# Altium schematic sheet Camera module.SchDoc
size A3; SheetNumber: 6; SheetTotal: 9
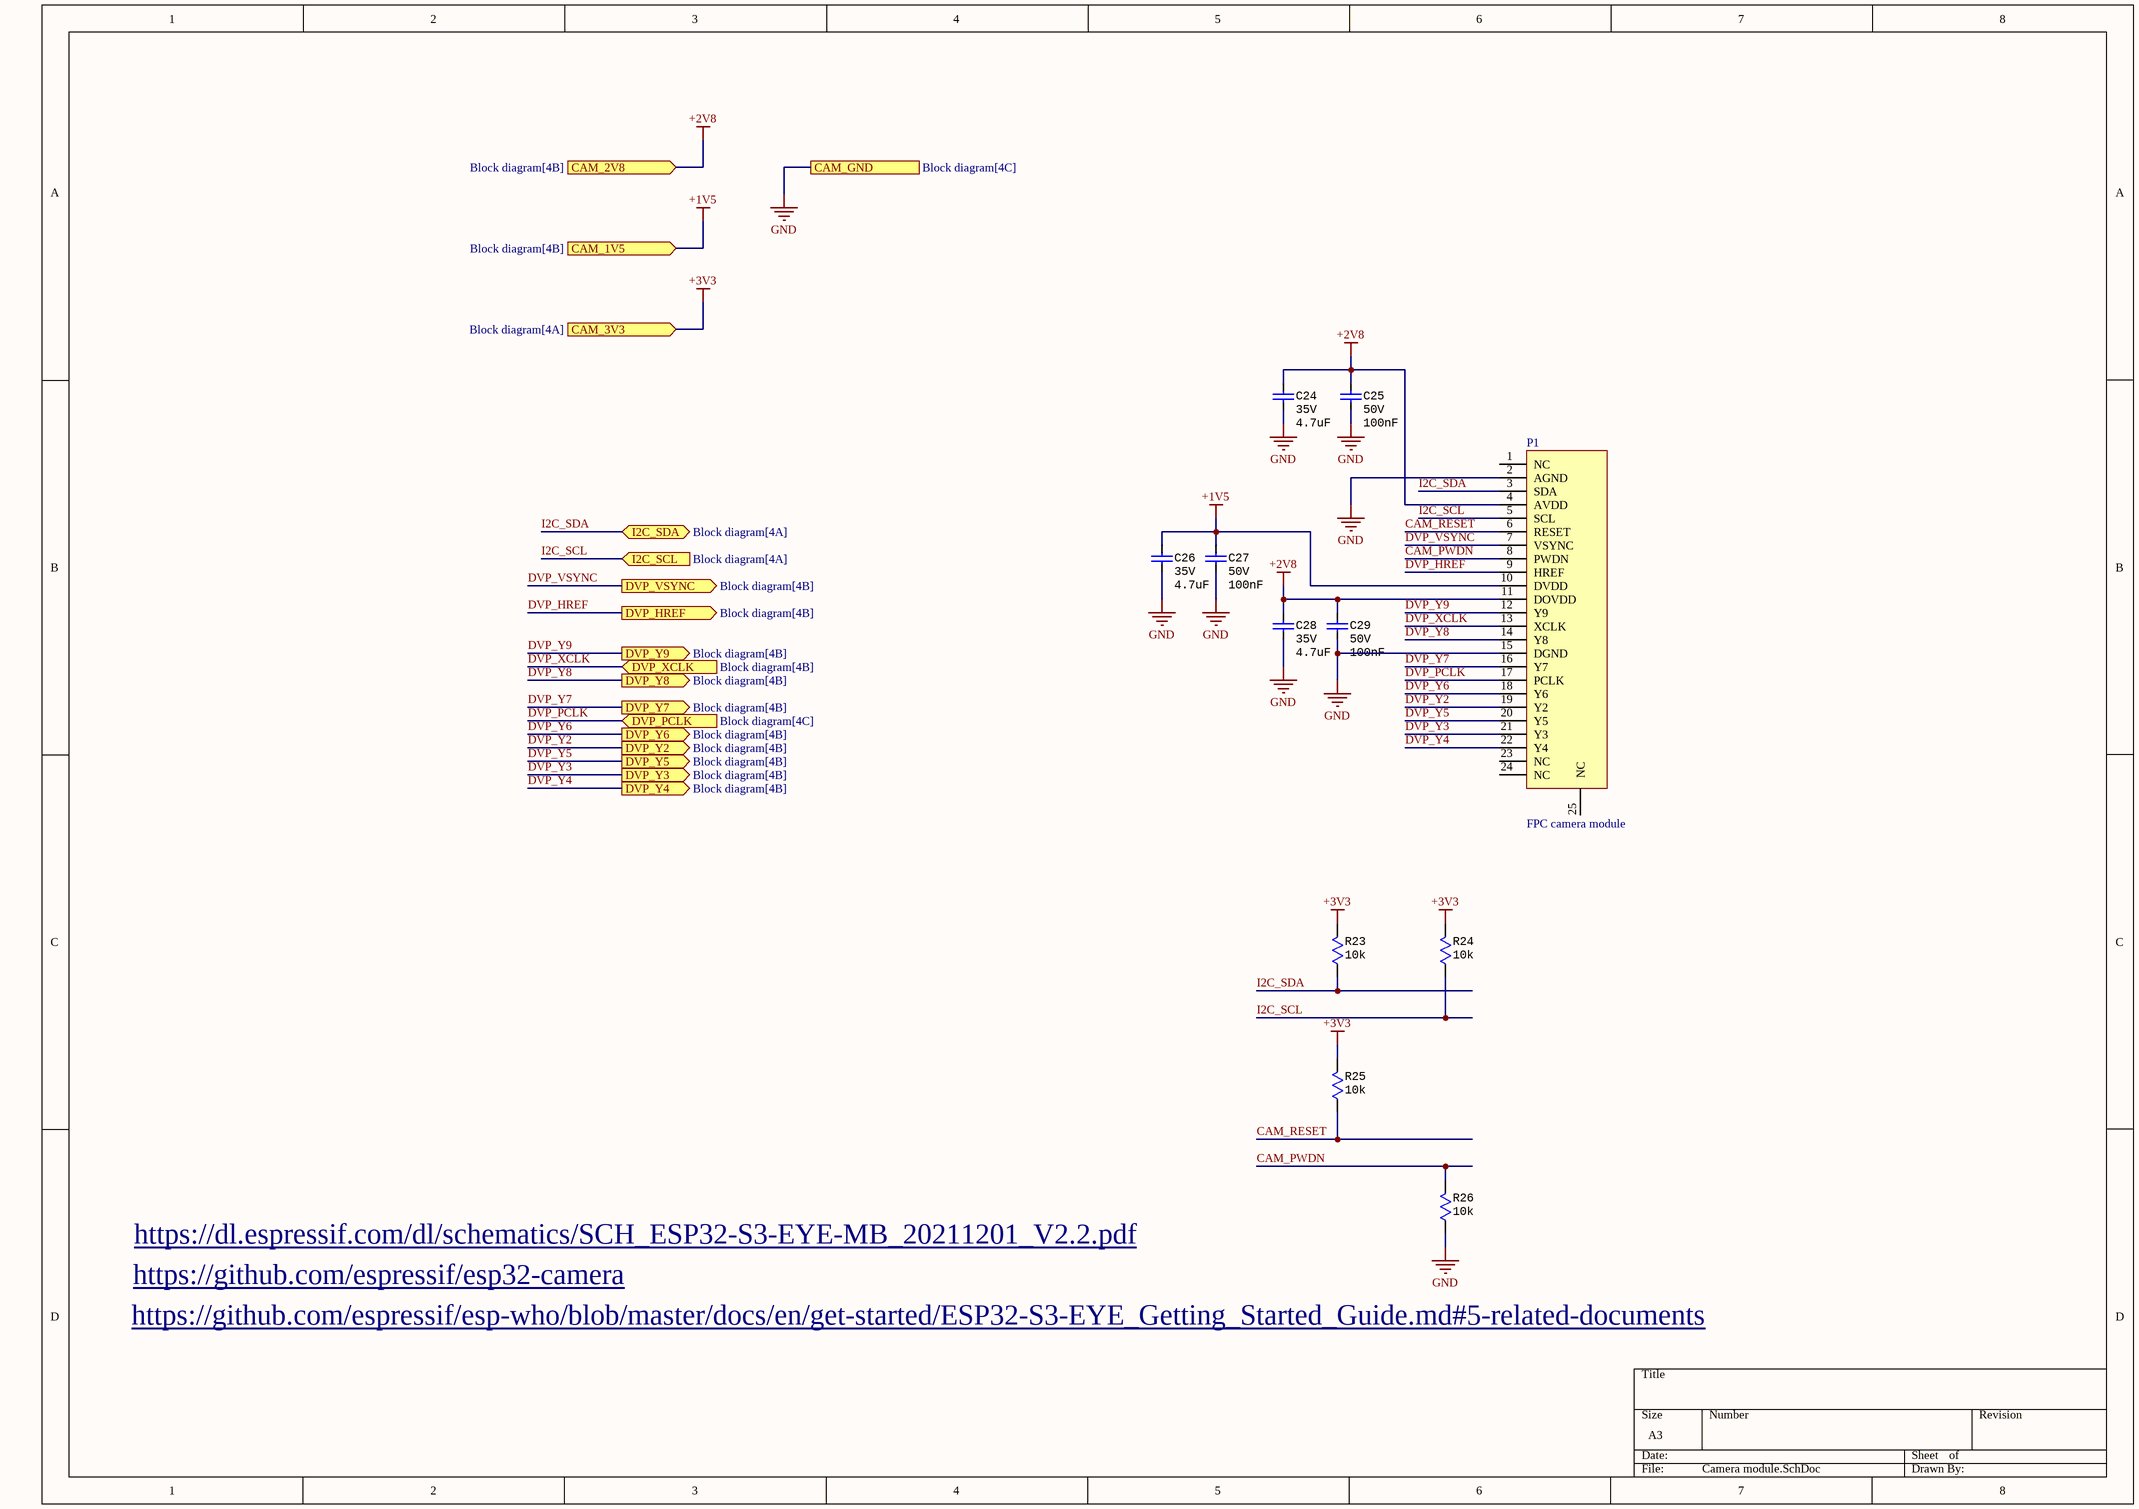
[diagram p0: Camera module.SchDoc]

## Parts
C24  Voltage: 35V  [CAP Ceramic SMD 0603]  (hidden comment: 4.7uF)
C25  Voltage: 50V  [CAP Ceramic SMD 0603]  (hidden comment: 100nF)
C26  Voltage: 35V  [CAP Ceramic SMD 0603]  (hidden comment: 4.7uF)
C27  Voltage: 50V  [CAP Ceramic SMD 0603]  (hidden comment: 100nF)
C28  Voltage: 35V  [CAP Ceramic SMD 0603]  (hidden comment: 4.7uF)
C29  Voltage: 50V  [CAP Ceramic SMD 0603]  (hidden comment: 100nF)
P1  FPC camera module  [FPC24 Camera Module]
R23  value 10k  [RES SMD 0603]  (hidden comment: 10kR)
R24  value 10k  [RES SMD 0603]  (hidden comment: 10kR)
R25  value 10k  [RES SMD 0603]  (hidden comment: 10kR)
R26  value 10k  [RES SMD 0603]  (hidden comment: 10kR)

## Ports
CAM_1V5 (in, see Block diagram[4B]), CAM_2V8 (in, see Block diagram[4B]), CAM_3V3 (in, see Block diagram[4A]), CAM_GND (see Block diagram[4C]), DVP_HREF (out, see Block diagram[4B]), DVP_PCLK (in, see Block diagram[4C]), DVP_VSYNC (out, see Block diagram[4B]), DVP_XCLK (in, see Block diagram[4B]), DVP_Y2 (out, see Block diagram[4B]), DVP_Y3 (out, see Block diagram[4B]), DVP_Y4 (out, see Block diagram[4B]), DVP_Y5 (out, see Block diagram[4B]), DVP_Y6 (out, see Block diagram[4B]), DVP_Y7 (out, see Block diagram[4B]), DVP_Y8 (out, see Block diagram[4B]), DVP_Y9 (out, see Block diagram[4B]), I2C_SCL (in, see Block diagram[4A]), I2C_SDA (bidir, see Block diagram[4A])

## Nets
+1V5: C26.1 C27.1 P1.10(DVDD) ; port CAM_1V5
+2V8: C24.1 C25.1 C28.1 C29.1 P1.4(AVDD) P1.11(DOVDD) ; port CAM_2V8
+3V3: R23.2 R24.2 R25.2 ; port CAM_3V3
GND: C24.2 C25.2 C26.2 C27.2 C28.2 C29.2 P1.2(AGND) P1.15(DGND) R26.1 ; port CAM_GND
CAM_PWDN: P1.8(PWDN) R26.2
CAM_RESET: P1.6(RESET) R25.1
DVP_HREF: P1.9(HREF) ; port DVP_HREF
DVP_PCLK: P1.17(PCLK) ; port DVP_PCLK
DVP_VSYNC: P1.7(VSYNC) ; port DVP_VSYNC
DVP_XCLK: P1.13(XCLK) ; port DVP_XCLK
DVP_Y2: P1.19(Y2) ; port DVP_Y2
DVP_Y3: P1.21(Y3) ; port DVP_Y3
DVP_Y4: P1.22(Y4) ; port DVP_Y4
DVP_Y5: P1.20(Y5) ; port DVP_Y5
DVP_Y6: P1.18(Y6) ; port DVP_Y6
DVP_Y7: P1.16(Y7) ; port DVP_Y7
DVP_Y8: P1.14(Y8) ; port DVP_Y8
DVP_Y9: P1.12(Y9) ; port DVP_Y9
I2C_SCL: P1.5(SCL) R24.1 ; port I2C_SCL
I2C_SDA: P1.3(SDA) R23.1 ; port I2C_SDA

Not connected (* = marked no-connect by the designer): P1 1(NC) 23(NC) 24(NC) 25(NC)

## Notes on the sheet
- https://dl.espressif.com/dl/schematics/SCH_ESP32-S3-EYE-MB_20211201_V2.2.pdf
- https://github.com/espressif/esp32-camera
- https://github.com/espressif/esp-who/blob/master/docs/en/get-started/ESP32-S3-EYE_Getting_Started_Guide.md#5-related-documents

## Library data of the parts
C24 C26 C28 = CAP 0603 4.7uF 35V: Multilayer Ceramic Capacitor, 4.7 uF, 35 V, ± 10%, X5R, 0603 [1608 Metric]; Manufacturer: Murata; Manufacturer Part Number: GRM188R6YA475KE15D; Supplier 1: LCSC; Supplier Part Number 1: C162274; RoHS: Yes; Category: Ceramic Capacitors; Stock 1: 52180; Pricing 1: 10=0.05850, 100=0.04900, 300=0.04430, 1000=0.03020, 4000=0.02820, 8000=0.02710 (USD); Mount: Surface Mount; Case/Package: 0603; Case Code (Metric): 1608; Case Code (Imperial): 0603; Weight: 0.000222oz; Material: Ceramic; Min Operating Temperature: -55°C; Max Operating Temperature: 85°C; Capacitance: 4.7uF; Tolerance: 10%; Voltage Rating: 35V; Packaging: Tape and Reel; Package Quantity: 1; Dielectric: X5R; Series: GRM; Voltage Rating (DC): 35V; Termination: SMD/SMT; Resistor Type: Ceramic; Length: 1.6mm; Width: 0.8mm; Height: 0.8mm; Thickness: 0.031inch; Depth: 0.8mm; RoHS Compliant: Yes; Lead Free: Lead Free; Reach SVHC Compliant: Yes; Value: 4.7uF
C25 C27 C29 = CAP 0603 100nF 50V: Multilayer Ceramic Capacitors MLCC Surface Mount 0603 0.1uF 50 Volts X7R 10%; Manufacturer: Murata; Manufacturer Part Number: GRM188R71H104KA93D; Insulation Resistance: 10GR; Supplier 1: LCSC; RoHS: Yes; Category: Ceramic Capacitors; Stock 1: 3546650; Pricing 1: 50=0.00420, 500=0.00330, 1500=0.00290, 5000=0.00260, 25000=0.00250, 50000=0.00240 (USD); Mount: Surface Mount; Case/Package: 0603; Number of Pins: 2; Case Code (Imperial): 0603; Case Code (Metric): 1608; Dielectric Material: Ceramic; Material: Ceramic; Contact Plating: Tin,Matte; Min Operating Temperature: -55°C; Max Operating Temperature: 125°C; Capacitance: 100nF; Tolerance: 10%; Packaging: Tape and Reel; Dielectric: X7R; Voltage Rating (DC): 50V; Termination: SMD/SMT; Package Quantity: 1; Voltage Rating: 50V; Length: 1.6mm; Width: 0.8mm; Height: 0.8mm; Depth: 0.8mm; Thickness: 0.035inch; Radiation Hardening: No; RoHS Compliant: Yes; REACH SVHC: No SVHC; Lead Free: Lead Free; ComponentLink1URL: https://datasheet.ciiva.com/19467/1857604-19467681.pdf?src-supplier=Jameco; ComponentLink1Description: https://datasheet.ciiva.com/19467/1857604-19467681.pdf?src-supplier=Jameco; ComponentLink2URL: https://datasheet.ciiva.com/11786/0900766b807a1cab-11786047.pdf?src-supplier=RSComponents; ComponentLink2Description: https://datasheet.ciiva.com/11786/0900766b807a1cab-11786047.pdf?src-supplier=RSComponents; ComponentLink3URL: https://datasheet.ciiva.com/29201/451744-da-01-en-vs-kondensator-0603-29201904.pdf?src-supplier=Conrad; ComponentLink3Description: https://datasheet.ciiva.com/29201/451744-da-01-en-vs-kondensator-0603-29201904.pdf?src-supplier=Conrad; ComponentLink4URL: https://datasheet.ciiva.com/7937/4360-7937659.pdf?src-supplier=Element14; ComponentLink4Description: https://datasheet.ciiva.com/7937/4360-7937659.pdf?src-supplier=Element14; ComponentLink5URL: https://datasheet.ciiva.com/14116/nmgrm-data-en-14116602.pdf?src-supplier=Distrelec; ComponentLink5Description: https://datasheet.ciiva.com/14116/nmgrm-data-en-14116602.pdf?src-supplier=Distrelec; ComponentLink6URL: https://datasheet.ciiva.com/48436/nmgrm-data-en-48436667.pdf?src-supplier=Distrelec; ComponentLink6Description: https://datasheet.ciiva.com/48436/nmgrm-data-en-48436667.pdf?src-supplier=Distrelec; ComponentLink7URL: https://datasheet.ciiva.com/28534/4360-28534245.pdf?src-supplier=Element14; ComponentLink7Description: https://datasheet.ciiva.com/28534/4360-28534245.pdf?src-supplier=Element14; ComponentLink8URL: https://datasheet.ciiva.com/131/partnumbering-e-01-131739.pdf?src-supplier=Digi-Key; ComponentLink8Description: https://datasheet.ciiva.com/131/partnumbering-e-01-131739.pdf?src-supplier=Digi-Key; ComponentLink9URL: https://datasheet.ciiva.com/131/partnumbering-e-01-131738.pdf?src-supplier=Digi-Key; ComponentLink9Description: https://datasheet.ciiva.com/131/partnumbering-e-01-131738.pdf?src-supplier=Digi-Key; ComponentLink10URL: https://datasheet.ciiva.com/131/partnumbering-e-01-131740.pdf?src-supplier=Digi-Key; ComponentLink10Description: https://datasheet.ciiva.com/131/partnumbering-e-01-131740.pdf?src-supplier=Digi-Key; ComponentLink11URL: https://datasheet.ciiva.com/7937/1747470-7937658.pdf?src-supplier=Element14; ComponentLink11Description: https://datasheet.ciiva.com/7937/1747470-7937658.pdf?src-supplier=Element14; Supplier Part Number 1: C77055; Value: 100nF
P1 = FPC camera module: OV9655 FPC24 1.3Mp CMOS Camera Module / + Clamshell 24 Bottom Contact Surface Mount 0.5mm SMD,P=0.5mm FFC/FPC Connectors ROHS; Manufacturer: JUSHUO; ManufacturerPartNumber: AFC01-S24FCA-00; Supplier: LCSC; SupplierPartNumber: C262669
R23-R26 = RES 0603 10k 1%: Res Thick Film 0603 10K Ohm 1% 1/10W ±100ppm/°C Molded SMD Punched Carrier T/R; Manufacturer: Panasonic; Manufacturer Part Number: ERJ-3EKF1002V; Max Power Dissipation: 100mW; Voltage Rating: 75V; Supplier 1: LCSC; RoHS: Yes; Category: Chip SMD Resistors; Stock 1: 555600; Pricing 1: 50=0.010200, 500=0.008400, 1500=0.007300, 5000=0.006100, 25000=0.005500, 50000=0.005400 (AUD); Mount: Surface Mount; Case/Package: 0603; Number of Pins: 2; Case Code (Metric): 1608; Case Code (Imperial): 0603; Contact Plating: Tin; Size Code: 0603; Min Operating Temperature: -55°C; Max Operating Temperature: 155°C; Resistance: 10kR; Packaging: Tape and Reel; Resistor Type: Thick Film; Temperature Coefficient: 100ppm/°C; Tolerance: 1%; Number of Terminations: 2; Series: ERJ; Construction: Rectangular; Power Rating: 100mW; Features: Automotive AEC-Q200; Voltage Rating (DC): 75V; Package Quantity: 1; Resistance Tolerance: 1%; Termination: SMD/SMT; Technology: THICK FILM; Length: 1.6mm; Width: 0.031inch; Height: 0.45mm; Depth: 0.8mm; Radiation Hardening: No; RoHS Compliant: Yes; Military Standard: Not; Lead Free: Lead Free; REACH SVHC: No SVHC; ComponentLink1URL: https://datasheet.ciiva.com/7830/aoa0000ce2-7830729.pdf?src-supplier=Element14; ComponentLink1Description: https://datasheet.ciiva.com/7830/aoa0000ce2-7830729.pdf?src-supplier=Element14; ComponentLink2URL: https://datasheet.ciiva.com/46372/1678782-46372725.pdf?src-supplier=Element14; ComponentLink2Description: https://datasheet.ciiva.com/46372/1678782-46372725.pdf?src-supplier=Element14; ComponentLink3URL: https://datasheet.ciiva.com/28514/426256-28514198.pdf?src-supplier=Element14; ComponentLink3Description: https://datasheet.ciiva.com/28514/426256-28514198.pdf?src-supplier=Element14; ComponentLink4URL: https://datasheet.ciiva.com/24070/aoa0000ce2-24070318.pdf?src-supplier=Mouser; ComponentLink4Description: https://datasheet.ciiva.com/24070/aoa0000ce2-24070318.pdf?src-supplier=Mouser; ComponentLink5URL: https://datasheet.ciiva.com/16759/70260748-16759807.pdf?src-supplier=Allied+Electronics; ComponentLink5Description: https://datasheet.ciiva.com/16759/70260748-16759807.pdf?src-supplier=Allied+Electronics; ComponentLink6URL: https://datasheet.ciiva.com/9194/aoa0000ce2-9194199.pdf?src-supplier=Avnet; ComponentLink6Description: https://datasheet.ciiva.com/9194/aoa0000ce2-9194199.pdf?src-supplier=Avnet; ComponentLink7URL: https://datasheet.ciiva.com/48530/aoa0000ce2-48530988.pdf?src-supplier=Avnet; ComponentLink7Description: https://datasheet.ciiva.com/48530/aoa0000ce2-48530988.pdf?src-supplier=Avnet; ComponentLink8URL: https://datasheet.ciiva.com/30208/aoa0000ce2-30208985.pdf?src-supplier=Onlinecomponents.com; ComponentLink8Description: https://datasheet.ciiva.com/30208/aoa0000ce2-30208985.pdf?src-supplier=Onlinecomponents.com; Supplier Part Number 1: C191124